# Altium schematic sheet Sheet2.SchDoc
size A
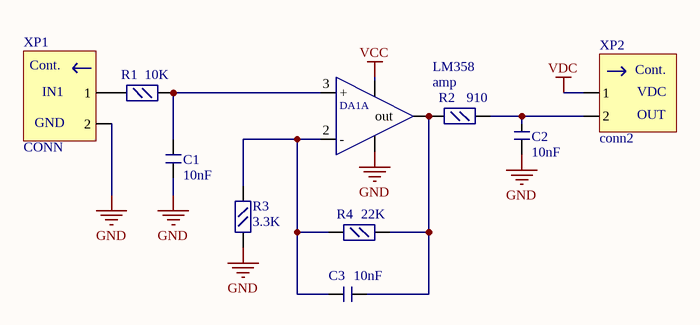
[diagram p0: Sheet2.SchDoc]

## Parts
C1  10nF
C2  10nF
C3  10nF
LM358  amp
R1  10K
R2  910
R3  3.3K
R4  22K
XP1  CONN
XP2  conn2

## Nets
GND: C1.9 C2.9 LM358.14 R3.7 XP1.18(2)
VCC: LM358.15
VDC: XP2.19(1)
NetC1_10: C1.10 LM358.3(+) R1.8
NetC2_10: C2.10 R2.8 XP2.19(2)
NetC3_9: C3.9 LM358.2(-) R3.8 R4.7
NetC3_10: C3.10 LM358.13(out) R2.7 R4.8
NetR1_7: R1.7 XP1.17(1)

## Notes on the sheet
- (in symbol amp) DA1A
- (in symbol CONN) Cont.; IN1; GND
- (in symbol conn2) Cont.; VDC; OUT

## Library data of the parts
C1-C3 = capacitor
R1-R4 = resistor